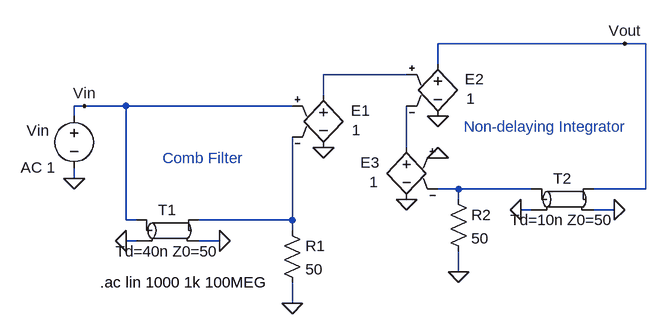
[diagram p0: schematic _Fig4_13_K_is_4_AC_MSD.asc]
_Fig4_13_K_is_4_AC_MSD.asc, the LTspice schematic file:
Version 4
SHEET 1 1372 688
WIRE 1040 208 752 208
WIRE 1072 208 1040 208
WIRE 752 240 752 208
WIRE 704 256 576 256
WIRE 576 288 576 256
WIRE 208 304 192 304
WIRE 272 304 208 304
WIRE 528 304 272 304
WIRE 192 320 192 304
WIRE 704 368 704 304
WIRE 192 416 192 400
WIRE 784 432 752 432
WIRE 896 432 784 432
WIRE 1072 432 1072 208
WIRE 1072 432 992 432
WIRE 784 448 784 432
WIRE 896 464 880 464
WIRE 1024 464 992 464
WIRE 272 480 272 304
WIRE 288 480 272 480
WIRE 528 480 528 352
WIRE 528 480 384 480
WIRE 528 496 528 480
WIRE 288 512 272 512
WIRE 416 512 384 512
WIRE 784 560 784 528
WIRE 528 608 528 576
FLAG 528 608 0
FLAG 416 512 0
FLAG 272 512 0
FLAG 192 416 0
FLAG 208 304 Vin
FLAG 576 368 0
FLAG 784 560 0
FLAG 1024 464 0
FLAG 880 464 0
FLAG 1040 208 Vout
FLAG 752 320 0
FLAG 704 448 0
FLAG 752 384 0
SYMBOL tline 336 496 R0
SYMATTR InstName T1
SYMATTR Value Td=40n Z0=50
SYMBOL res 512 480 R0
SYMATTR InstName R1
SYMATTR Value 50
SYMBOL voltage 192 304 R0
WINDOW 0 -73 38 Left 0
WINDOW 123 -82 95 Left 0
WINDOW 39 0 0 Left 0
SYMATTR InstName Vin
SYMATTR Value2 AC 1
SYMATTR Value ""
SYMBOL e 576 272 R0
WINDOW 0 42 39 Left 0
WINDOW 3 44 69 Left 0
SYMATTR InstName E1
SYMATTR Value 1
SYMBOL tline 944 448 R0
SYMATTR InstName T2
SYMATTR Value Td=10n Z0=50
SYMBOL res 768 432 R0
SYMATTR InstName R2
SYMATTR Value 50
SYMBOL e 752 224 R0
WINDOW 0 42 39 Left 0
WINDOW 3 44 69 Left 0
SYMATTR InstName E2
SYMATTR Value 1
SYMBOL e 704 352 M0
WINDOW 0 42 39 Left 0
WINDOW 3 44 69 Left 0
SYMATTR InstName E3
SYMATTR Value 1
TEXT 232 576 Left 0 !.ac lin 1000 1k 100MEG
TEXT 328 384 Left 0 ;Comb Filter
TEXT 792 336 Left 0 ;Non-delaying Integrator

The netlist it stands for:
* _Fig4_13_K_is_4_AC_MSD.asc
T1 Vin 0 N004 0 Td=40n Z0=50
R1 N004 0 50
Vin Vin 0 AC 1
E1 N001 0 Vin N004 1
T2 N003 0 Vout 0 Td=10n Z0=50
R2 N003 0 50
E2 Vout 0 N001 N002 1
E3 N002 0 0 N003 1
.ac lin 1000 1k 100MEG
* Comb Filter
* Non-delaying Integrator
.backanno
.end